# EAGLE design 4x_1206 (EAGLE 7.3.0)
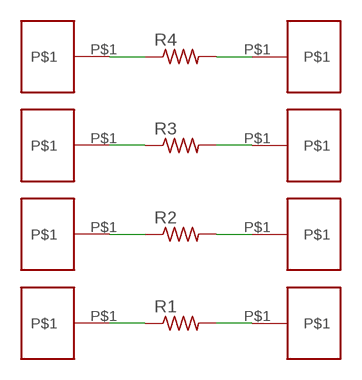
[diagram p0: schematic, sheet 1]

## Parts
R1  R-US_R1206  [R1206]
R2  R-US_R1206  [R1206]
R3  R-US_R1206  [R1206]
R4  R-US_R1206  [R1206]
U$1  PAD100MIL  [100MIL_PAD]
U$2  PAD100MIL  [100MIL_PAD]
U$3  PAD100MIL  [100MIL_PAD]
U$4  PAD100MIL  [100MIL_PAD]
U$5  PAD100MIL  [100MIL_PAD]
U$6  PAD100MIL  [100MIL_PAD]
U$7  PAD100MIL  [100MIL_PAD]
U$8  PAD100MIL  [100MIL_PAD]

## Nets
N$1: R4.1 U$1.P$1
N$2: R4.2 U$5.P$1
N$3: R3.2 U$6.P$1
N$4: R3.1 U$2.P$1
N$5: R2.1 U$3.P$1
N$6: R2.2 U$7.P$1
N$7: R1.2 U$8.P$1
N$8: R1.1 U$4.P$1

## Library data of the parts
R1-R4 = z0:R-US_: RESISTOR, American symbol
U$1-U$8 = generic_smd:PAD

## Board
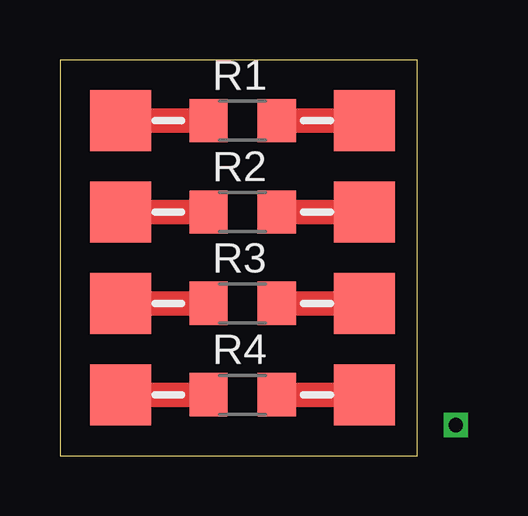
[diagram p1: board, top side]
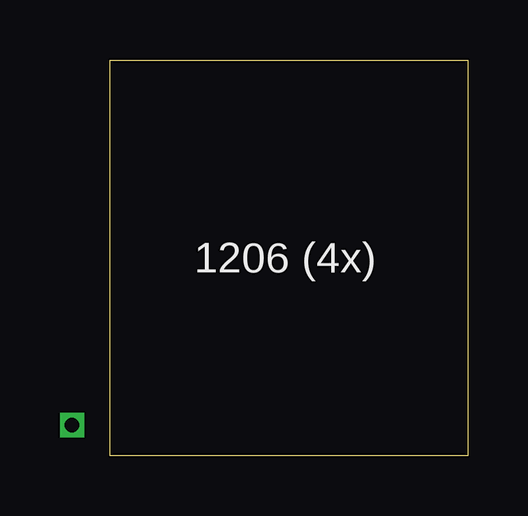
[diagram p2: board, bottom side, seen from below]

Size 14.91 x 16.5 mm. Coordinates in mm from the lower left corner, seen from the top.
Outline: 0,0 14.91,0 14.91,16.5 0,16.5 0,0
Copper layers (1*16): Top 0.035mm / dielectric 1.5mm / Bottom 0.035mm
Design rules "default": minimum track width 10mil, minimum drill 24mil, track to track 8mil, track to pad 8mil, pad to pad 8mil, via to via 8mil, smd to smd 8mil, copper to edge 40mil, drill to drill 8mil, minimum pad ring 10mil, minimum via ring 8mil, stop-mask expansion 4mil, vias tented up to drill 0mil, thermal gap 10mil

### Footprints (pad centres in the part's own frame; a part is rotated, then mirrored left to right if it is on the bottom)
R1206 = smd 1.6 x 1.803: 1 -1.422,0; 2 1.422,0
100MIL_PAD = smd 2.54 x 2.54: P$1 0,0

### Placement (x,y rotation side)
R1  7.62,13.97 0 top
R2  7.62,10.16 0 top
R3  7.62,6.35 0 top
R4  7.62,2.54 0 top
U$1  2.54,2.54 0 top
U$2  2.54,6.35 0 top
U$3  2.54,10.16 0 top
U$4  2.54,13.97 0 top
U$5  12.7,2.54 0 top
U$6  12.7,6.35 0 top
U$7  12.7,10.16 0 top
U$8  12.7,13.97 0 top

### Tracks (layer width: path | path; a pad name or v marks a point on that pad's centre or on a via)
N$1
  Top 1.016: R4.1 U$1.P$1
N$2
  Top 1.016: U$5.P$1 R4.2
N$3
  Top 1.016: R3.2 U$6.P$1
N$4
  Top 1.016: R3.1 U$2.P$1
N$5
  Top 1.016: R2.1 U$3.P$1
N$6
  Top 1.016: R2.2 U$7.P$1
N$7
  Top 1.016: R1.2 U$8.P$1
N$8
  Top 1.016: U$4.P$1 R1.1
N$9  (via drill 0.6)
  other vias: 16.51,1.27

### Text on the board
bPlace: 1206 (4x)
Document: via required to force drill file generation